# Altium schematic sheet Battery_07.SchDoc
size A2; SheetNumber: 1; SheetTotal: 9
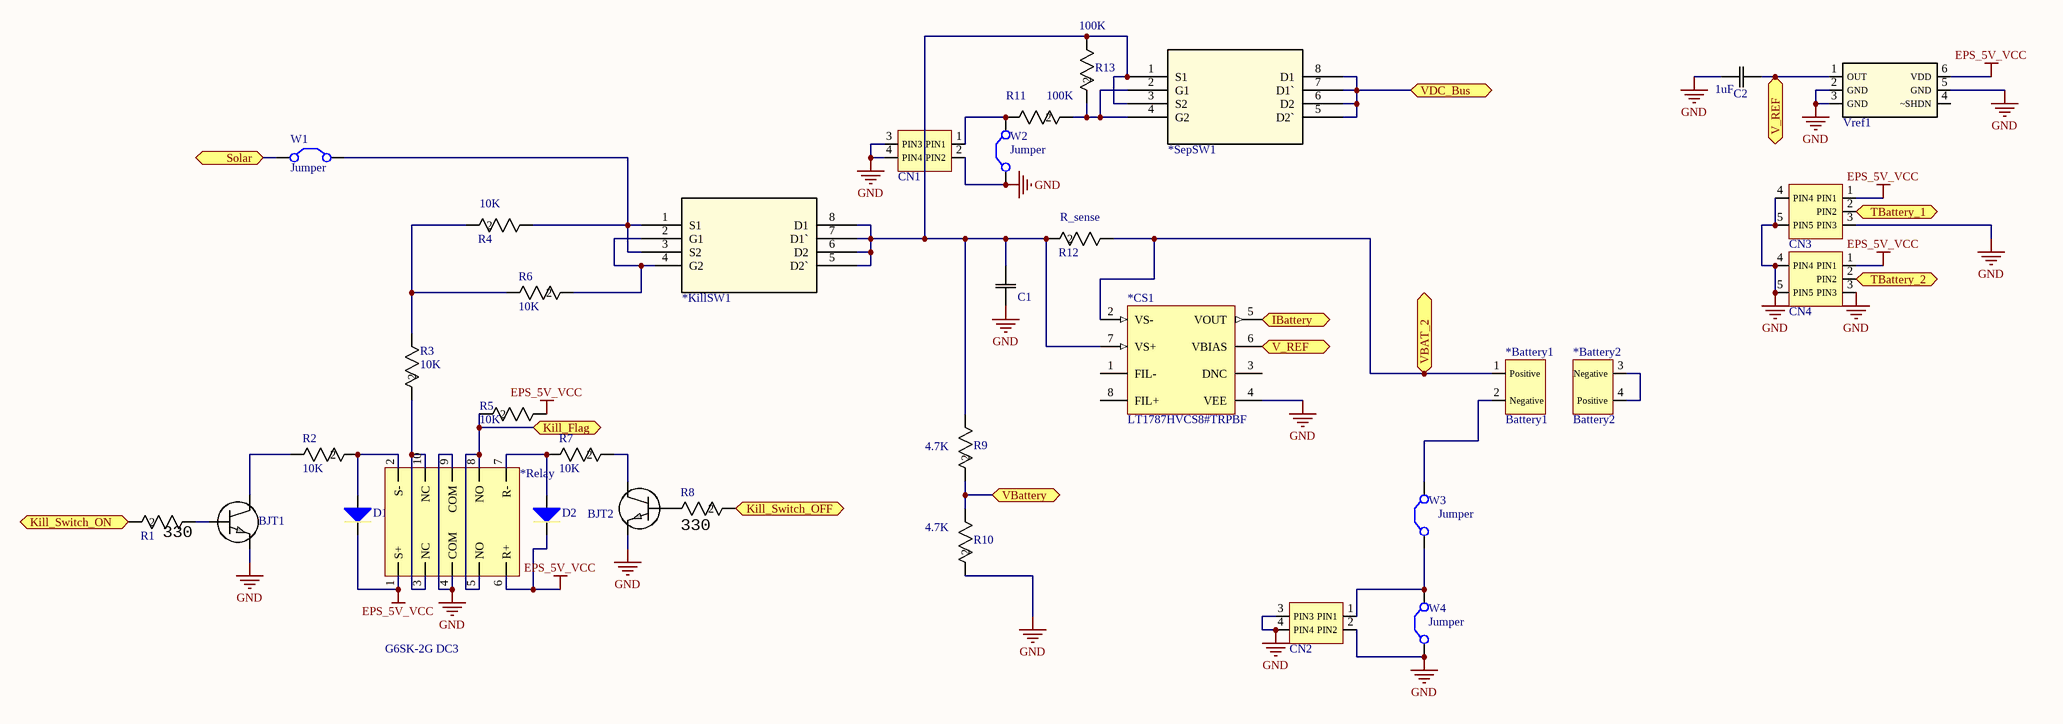
[diagram p0: Battery_07.SchDoc]

## Parts
*Battery1  Battery1  [Battery1]
*Battery2  Battery2  [BATTERY2]
*CS1  LT1787HVCS8#TRPBF  [LT-S8-8_N]
*KillSW1  IRF7329TRPBF  [SO8_L]  (value not drawn)
*Relay  G6SK-2G DC3  [G6SK-2G DC3]
*SepSW1  IRF7329TRPBF  [SO8_L]  (value not drawn)
BJT1  MMBT2222A  [SOT-23A_L]  (value not drawn)
BJT2  MMBT2222A  [SOT-23A_L]  (value not drawn)
C1  GRM188R71H472KA0  [RC0805N]  (value not drawn)
C2  1uF  [0805]
CN1  SM02B-SRSS  [2pins]  (value not drawn)
CN2  SM02B-SRSS  [2pins]  (value not drawn)
CN3  SM03B-SRSS  [3pins]  (value not drawn)
CN4  SM03B-SRSS  [3pins]  (value not drawn)
D1  MMSD459A  [GeneralDiode]  (value not drawn)
D2  MMSD459A  [GeneralDiode]  (value not drawn)
R1  330  [RC0805N]
R2  10K  [RC0805N]
R3  10K  [RC0805N]
R4  10K  [RC0805N]
R5  10K  [RC0805N]
R6  10K  [RC0805N]
R7  10K  [RC0805N]
R8  330  [RC0805N]
R9  4.7K  [RC0805N]
R10  4.7K  [RC0805N]
R11  100K  [RC0805N]
R12  R_sense  [RC0805N]
R13  100K  [RC0805N]
Vref1  ADR3450ARJZ-R2  [RJ_6-M]  (value not drawn)
W1  Jumper  [RAD-0.1]
W2  Jumper  [RAD-0.1]
W3  Jumper  [RAD-0.1]
W4  Jumper  [RAD-0.1]

## Ports
IBattery, Kill_Flag, Kill_Switch_OFF, Kill_Switch_ON, Solar, TBattery_1, TBattery_2, V_REF, VBAT_2, VBattery, VDC_Bus

## Nets
EPS_5V_VCC: *Relay.1(S+) *Relay.6(R+) CN3.1(PIN1) CN4.1(PIN1) D1.2(K) D2.2(K) R5.1 Vref1.6(VDD)
GND: *CS1.4(VEE) *Relay.4(COM) *Relay.9(COM) BJT1.3(E) BJT2.3(E) C1.1 C2.1 CN1.2(PIN2) CN1.3(PIN3) CN1.4(PIN4) CN2.2(PIN2) CN2.3(PIN3) CN2.4(PIN4) CN3.3(PIN3) CN3.4(PIN4) CN3.5(PIN5) CN4.3(PIN3) CN4.4(PIN4) CN4.5(PIN5) R10.2 Vref1.2(GND) Vref1.3(GND) Vref1.5(GND) W2.1(C1) W4.1(C1)
IBattery: *CS1.5(VOUT) ; port IBattery
Kill_Flag: *Relay.5(NO) *Relay.8(NO) R5.2 ; port Kill_Flag
Kill_Switch_OFF: R8.2 ; port Kill_Switch_OFF
Kill_Switch_ON: R1.2 ; port Kill_Switch_ON
Solar: W1.1(C1) ; port Solar
TBattery_1: CN3.2(PIN2) ; port TBattery_1
TBattery_2: CN4.2(PIN2) ; port TBattery_2
V_REF: *CS1.6(VBIAS) C2.2 Vref1.1(OUT) ; port V_REF
VBAT_2: *Battery1.1(Positive) *CS1.2(VS-) R12.1 ; port VBAT_2
VBattery: R9.2 R10.1 ; port VBattery
VDC_Bus: *SepSW1.5(D2`) *SepSW1.6(D2) *SepSW1.7(D1`) *SepSW1.8(D1) ; port VDC_Bus
Net*Battery1_2: *Battery1.2(Negative) W3.2(C2)
Net*Battery2_3: *Battery2.3(Negative) *Battery2.4(Positive)
Net*CS1_7: *CS1.7(VS+) *KillSW1.5(D2`) *KillSW1.6(D2) *KillSW1.7(D1`) *KillSW1.8(D1) *SepSW1.1(S1) *SepSW1.3(S2) C1.2 R9.1 R12.2 R13.1
Net*KillSW1_1: *KillSW1.1(S1) *KillSW1.3(S2) R4.1 W1.2(C2)
Net*KillSW1_2: *KillSW1.2(G1) *KillSW1.4(G2) R6.2
Net*Relay_2: *Relay.2(S-) D1.1(A) R2.2
Net*Relay_3: *Relay.3(NC) *Relay.10(NC) R3.2
Net*Relay_7: *Relay.7(R-) D2.1(A) R7.1
Net*SepSW1_2: *SepSW1.2(G1) *SepSW1.4(G2) R11.2 R13.2
NetBJT1_1: BJT1.1(B) R1.1
NetBJT1_2: BJT1.2(C) R2.1
NetBJT2_1: BJT2.1(B) R8.1
NetBJT2_2: BJT2.2(C) R7.2
NetCN1_1: CN1.1(PIN1) R11.1 W2.2(C2)
NetCN2_1: CN2.1(PIN1) W3.1(C1) W4.2(C2)
NetR3_1: R3.1 R4.2 R6.1

Not connected (* = marked no-connect by the designer): *CS1 1(FIL-) 3(DNC) 8(FIL+); Vref1 4(~SHDN)

## Library data of the parts
*CS1 = LT1787HVCS8#TRPBF: Single Channel, High Side Current Sense, 60 V Supply Operation, Precision Operational Amplifier, 0.115 MHz Typical GBW, 2.5 to 60 V, 8-Pin SOIC (S8-8), Commercial, Pb-Free, Reel; Manufacturer: Linear Technology; Channels (#): 1; GBW (MHz) Typical: 0.115; Is (mA) Typical: 0.06; Vos (mV) Guaranteed: 0.075; Vos (mV) Typical: 0.04; Vs Max (V): 60; Vs Min (V): 2.5; DatasheetVersion: Rev. C; PackageVersion: Rev G; PackageReference: LT-S8-8; PackageDescription: 8-Pin Plastic Small Outline, Body 4.9 x 3.9 mm, Pitch 1.27 mm; Supplier 1: Digi-Key; Supplier Part Number 1: LT1787HVCS8#TRPBF-ND; Supplier 2: Newark; Supplier Part Number 2: 57M6449; Packing: Reel; Linear Technology Part Number: LT1787HV; RoHS: Pb-Free; Type: CSA; Mounting Technology: Surface Mount; PartNumber: LT1787HVCS8#TRPBF; ComponentLink1Description: Manufacturer URL; ComponentLink1URL: http://www.linear.com/; ComponentLink2Description: Datasheet; ComponentLink2URL: http://cds.linear.com/docs/en/datasheet/1787fc.pdf; ComponentLink3Description: Package Specification; ComponentLink3URL: http://cds.linear.com/docs/en/packaging/05081610_G_SO8.pdf
*KillSW1 *SepSW1 = IRF7329TRPBF: P-MOSFET, DUAL PCh -12V 9.2A; Manufacturer: Infineon / IR; Number of Channels: 2 Channels; Manufacturer Part No: IRF7329TRPBF; Package/Case: SO-8; Mouser Part No: 942-IRF7329TRPBF
*Relay = Omron G6SK-2G: RELAY TELECOM DPDT 2A 3V
BJT1 BJT2 = 2STF1360: BJT, NPN; Vendor: ST Microelectronics; Current_-_Collector_(Ic)_(Max): 3A; Voltage_-_Collector_Emitter_Breakdown_(Max): 60V; Vce_Saturation_(Max)_@_Ib,_Ic: 500mV @ 150mA, 3A; DC_Current_Gain_(hFE)_(Min)_@_Ic,_Vce: 160 @ 1A, 2V; Power_-_Max: 1.4W; Frequency_-_Transition: 130MHz; Mounting_Type: Surface Mount; C: Copyright (C) 2015 Accelerated Designs. All rights reserved; Manufacturer_Part_Number: 2STF1360; DigiKeyPartNumber: 497-5211-2-ND; Quantity_Available: 5000; Copyright: Copyright (C) 2015 Accelerated Designs. All rights reserved; DataSheet: http://www.st.com/internet/com/TECHNICAL_RESOURCES/TECHNICAL_LITERATURE/DATASHEET/CD00073146.pdf; Transistor_Type: NPN; Current_-_Collector_Cutoff_(Max): -; Package_/_Case: TO-243AA; Supplier_Device_Package: SOT-89-3; Packaging: Tape &amp; Reel (TR); Value: Value
C1 = GRM188R71H472KA0: Ceramic Capacitor 47uF 0603; Manufacturer_Part_Number: GRM188R71H472KA01D; Vendor: Murata; C: Copyright (C) 2015 Accelerated Designs. All rights reserved; Copyright: Copyright (C) 2015 Accelerated Designs. All rights reserved; Value: Value; Package/Case: 0603 (1608 Metric)
C2 = GRM155R71H103KA8: Ceramic Capacitor 0402; Manufacturer_Part_Number: GRM155R71H103KA88D; Vendor: Murata; C: Copyright (C) 2015 Accelerated Designs. All rights reserved; Copyright: Copyright (C) 2015 Accelerated Designs. All rights reserved; Value: Value; Package/Case: 0402(1005metric)
CN1 CN2 = 2Pin_Connector: CONN HEADER SH 2POS SIDE 1MM TIN; Manufacturer Part Number: SM02B-SRSS-TB(LF)(SN); Manufacturer: JST Sales America Inc.; Digi-Key Part Number: 455-1802-1-ND; Contact Type: Male Pin
CN3 CN4 = 3PIN_Connector: CONN HEADER SH 3POS SIDE 1MM TIN; Manufacturer Part Number: SM03B-SRSS-TB(LF)(SN); Manufacturer: JST Sales America Inc.; Digi-Key Part Number: 455-1803-1-ND; Contact Type: Male Pin; Mounting Type: Surface Mount, Right Angle
D1 D2 = MMSD459A: Diode General Purpose, SOD-123; Published: 8-Jun-2000; LatestRevisionDate: 17-Jul-2002; LatestRevisionNote: Re-released for DXP Platform.; PackageReference: SOD-123; Publisher: Altium Limited; Code_JEDEC: DO-214-AA; Digikey Number: MMSD459ACT-ND
R1-R8 R11 R13 = RC0805FR: Thick Film Resistors 0805; Manufacturer_Part_Number: RC0805FR-074K7L; Vendor: Yageo; Resistance_In_Ohms: 4.70K; Power_(Watts): 0.125W, 1/8W; Tolerance: Â±1%; Lead_Style: Surface Mount (SMD - SMT); Voltage_-_Working: 150V; Temperature_Coefficient: Â±100ppm/Â°C; Resistance_(Ohms): 4.7K; Number_of_Terminations: 2; C: Copyright (C) 2015 Accelerated Designs. All rights reserved; DigiKeyPartNumber: 311-4.70KCRTR-ND; Quantity_Available: 0; Copyright: Copyright (C) 2015 Accelerated Designs. All rights reserved; DataSheet: http://www.yageo.com/documents/recent/PYu-RC0805_51_RoHS_L_4.pdf; Case: 0805 (2012 metric); Packaging: Tape &amp; Reel (TR); Composition: Thick Film; NewarkPartNumber: 10R0398; Features: -; Package_/_Case: 0805 (2012 Metric); Size_/_Dimension: 0.079" L x 0.049" W (2.00mm x 1.25mm); Height: 0.024" (0.60mm)
  R1 R8: Value: 330
  R2-R7 R11 R13: Value: Value
R9 R10 = RC0805FR: Thick Film Resistors 0805; Manufacturer_Part_Number: RC0805FR-074K7L; Vendor: Yageo; Resistance_In_Ohms: 4.70K; Power_(Watts): 0.125W, 1/8W; Tolerance: Â±1%; Lead_Style: Surface Mount (SMD - SMT); Voltage_-_Working: 150V; Temperature_Coefficient: Â±100ppm/Â°C; Number_of_Terminations: 2; C: Copyright (C) 2015 Accelerated Designs. All rights reserved; DigiKeyPartNumber: 311-4.70KCRTR-ND; Quantity_Available: 0; Copyright: Copyright (C) 2015 Accelerated Designs. All rights reserved; DataSheet: http://www.yageo.com/documents/recent/PYu-RC0805_51_RoHS_L_4.pdf; Case: 0805 (2012 metric); Packaging: Tape &amp; Reel (TR); Composition: Thick Film; NewarkPartNumber: 10R0398; Resistance_(Ohms): 4.7K; Features: -; Package_/_Case: 0805 (2012 Metric); Size_/_Dimension: 0.079" L x 0.049" W (2.00mm x 1.25mm); Height: 0.024" (0.60mm); Value: Value
R12 = RL0805FR-070R1L: Sense Resistor 100m ohm 0805; Vendor: Yageo; Resistance_In_Ohms: 0.10; Power_(Watts): 0.125W, 1/8W; Tolerance: Â±1%; Lead_Style: Surface Mount (SMD - SMT); Voltage_-_Working: 300V; Temperature_Coefficient: Â±600ppm/Â°C; Resistance_(Ohms): 0.1; Number_of_Terminations: 2; C: Copyright (C) 2015 Accelerated Designs. All rights reserved; DigiKeyPartNumber: 311-.10STR-ND; Manufacturer_Part_Number: RL0805FR-070R1L; Quantity_Available: 25000; Copyright: Copyright (C) 2015 Accelerated Designs. All rights reserved; DataSheet: http://www.yageo.com/documents/recent/PYu-RL_521_RoHS_L_5.pdf; Case: 0805 (2012 metric); Packaging: Tape &amp; Reel (TR); Composition: Thick Film; NewarkPartNumber: 66R6321; Features: Current Sense; Package_/_Case: 0805 (2012 Metric); Size_/_Dimension: 0.079" L x 0.049" W (2.00mm x 1.25mm); Height: 0.024" (0.60mm); Value: Value
Vref1 = ADR3412ARJZ-R2: Voltage Reference; Vendor: Analog Devices Inc; C: Copyright (C) 2015 Accelerated Designs. All rights reserved; Manufacturer_Part_Number: adr3412arjz-r2; Value: Value; Type: Type; RefDes: RefDes; Package/Case: SOT23-6
W1-W4 = Jumper: Jumper Wire; Published: 24-Mar-1999; LatestRevisionDate: 17-Jul-2002; LatestRevisionNote: Re-released for DXP Platform.; PackageReference: RAD-0.2; Publisher: Altium Limited; PackageDescription: Radial Cap, Thru-Hole; 2 Leads; 0.2 in Pin Spacing